# Altium project CW312_K82.PrjPcb
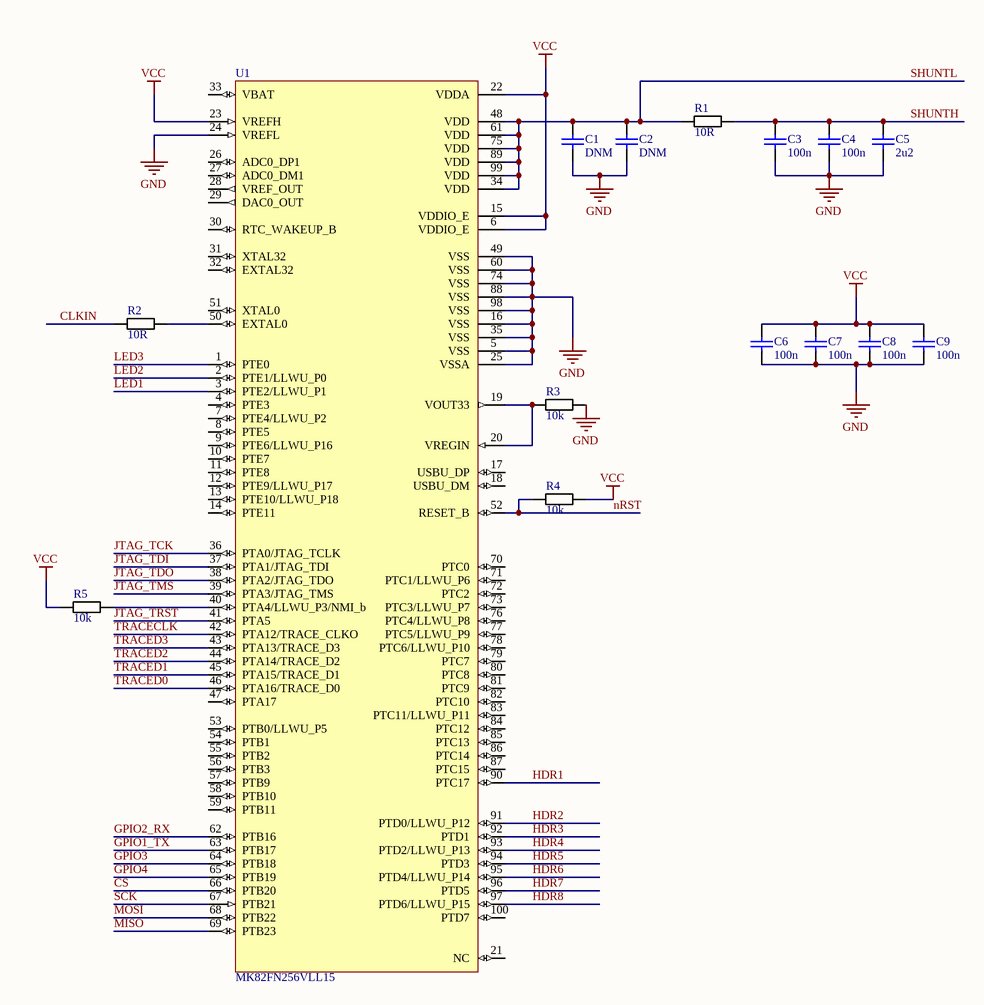
[diagram p0: CW312_K82.SchDoc]
PrjRev: 03; PrjName: K82 CW312 Target; PrjLicense: CC SA
2 sheets, 16 parts. Net scope: global (net labels, ports and power ports of the same name join across sheets).
Board files: cw312_k82.PcbDoc, CW312_K82_PANEL.PcbDoc
Sheets:
  CW312_K82.SchDoc
  CW312_K82_CardEdge.SchDoc

## Sheet CW312_K82.SchDoc: K82 Microcontroller
size Letter; Organization: NewAE Technology Inc.; Address1: 1083 Queen St., Suite 196; Address2: Halifax; Address3: NS; Address4: Canada B3H 0B2; DocumentNumber: .; Revision: .; SheetNumber: 1; SheetTotal: 2; SheetApproved: YES

### Parts
C1  DNM  [CAPC0603_M]
C2  DNM  [CAPC0603_M]
C3  100n  [CAPC0603_M]
C4  100n  [CAPC0603_M]
C5  2u2  [CAPC0603_M]
C6  100n  [CAPC0603_M]
C7  100n  [CAPC0603_M]
C8  100n  [CAPC0603_M]
C9  100n  [CAPC0603_M]
R1  10R  [RESC1608X55N]
R2  10R  [RESC1608X55N]
R3  10k  [RESC1608X55N]
R4  10k  [RESC1608X55N]
R5  10k  [RESC1608X55N]
U1  MK82FN256VLL15  [SQFP50P1600X1600X170-100N]

### Nets
GND: C1.2 C2.2 C3.2 C4.2 C5.2 C6.2 C7.2 C8.2 C9.2 R3.2 U1.5(VSS) U1.16(VSS) U1.24(VREFL) U1.25(VSSA) U1.35(VSS) U1.49(VSS) U1.60(VSS) U1.74(VSS) U1.88(VSS) U1.98(VSS)
VCC: C6.1 C7.1 C8.1 C9.1 R4.2 R5.1 U1.6(VDDIO_E) U1.15(VDDIO_E) U1.22(VDDA) U1.23(VREFH)  [project net FILTIN]
CLKIN: R2.1
CS: U1.66(PTB20)
GPIO1_TX: U1.63(PTB17)
GPIO2_RX: U1.62(PTB16)
GPIO3: U1.64(PTB18)
GPIO4: U1.65(PTB19)
HDR1: U1.90(PTC17)
HDR2: U1.91(PTD0/LLWU_P12)
HDR3: U1.92(PTD1)
HDR4: U1.93(PTD2/LLWU_P13)
HDR5: U1.94(PTD3)
HDR6: U1.95(PTD4/LLWU_P14)
HDR7: U1.96(PTD5)
HDR8: U1.97(PTD6/LLWU_P15)
JTAG_TCK: U1.36(PTA0/JTAG_TCLK)
JTAG_TDI: U1.37(PTA1/JTAG_TDI)
JTAG_TDO: U1.38(PTA2/JTAG_TDO)
JTAG_TMS: U1.39(PTA3/JTAG_TMS)
JTAG_TRST: U1.41(PTA5)
LED1: U1.3(PTE2/LLWU_P1)
LED2: U1.2(PTE1/LLWU_P0)
LED3: U1.1(PTE0)
MISO: U1.69(PTB23)
MOSI: U1.68(PTB22)
nRST: R4.1 U1.52(RESET_B)
SCK: U1.67(PTB21)
SHUNTH: C3.1 C4.1 C5.1 R1.2  [project net FILT_HP]
SHUNTL: C1.1 C2.1 R1.1 U1.34(VDD) U1.48(VDD) U1.61(VDD) U1.75(VDD) U1.89(VDD) U1.99(VDD)
TRACECLK: U1.42(PTA12/TRACE_CLKO)
TRACED0: U1.46(PTA16/TRACE_D0)
TRACED1: U1.45(PTA15/TRACE_D1)
TRACED2: U1.44(PTA14/TRACE_D2)
TRACED3: U1.43(PTA13/TRACE_D3)
NetR2_2: R2.2 U1.50(EXTAL0)
NetR3_1: R3.1 U1.19(VOUT33) U1.20(VREGIN)
NetR5_2: R5.2 U1.40(PTA4/LLWU_P3/NMI_b)

Not connected (* = marked no-connect by the designer): U1 4(PTE3) 7(PTE4/LLWU_P2) 8(PTE5) 9(PTE6/LLWU_P16) 10(PTE7) 11(PTE8) 12(PTE9/LLWU_P17) 13(PTE10/LLWU_P18) 14(PTE11) 17(USBU_DP) 18(USBU_DM) 21(NC) 26(ADC0_DP1) 27(ADC0_DM1) 28(VREF_OUT) 29(DAC0_OUT) 30(RTC_WAKEUP_B) 31(XTAL32) 32(EXTAL32) 33(VBAT) 47(PTA17) 51(XTAL0) 53(PTB0/LLWU_P5) 54(PTB1) 55(PTB2) 56(PTB3) 57(PTB9) 58(PTB10) 59(PTB11) 70(PTC0) 71(PTC1/LLWU_P6) 72(PTC2) 73(PTC3/LLWU_P7) 76(PTC4/LLWU_P8) 77(PTC5/LLWU_P9) 78(PTC6/LLWU_P10) 79(PTC7) 80(PTC8) 81(PTC9) 82(PTC10) 83(PTC11/LLWU_P11) 84(PTC12) 85(PTC13) 86(PTC14) 87(PTC15) 100(PTD7)

### Notes on the sheet
- Title:
- Date:
- Rev:
- Time:
- Project:
- Sheet
- of
- License:
- Copyright © NewAE Technology Inc.
- Approved:
- NewAE.com
- File:

### Library data of the parts
C1 C2 = CCHIP-100n-0603: Manufacture 1: Kemet; Manufacture Part Number 1: C0603C104K5RACTU; Component Group: Capacitor; Value: 100n; Case-EIA: 0603; Case-Metric: 1608; Rated Voltage: 50VDC; Part Number: CCHIP-100n-0603; Footprint: 0603; Pin Count: 2; Supplier 1: Digi-Key; Supplier Part Number 1: 399-5089-2-ND; Mounting Technology: SMT; Component Kind: Standard; Component Type: Standard
C3 C4 C6-C9 = CCHIP-100n-0603: 100n, 0603; Manufacture 1: Kemet; Manufacture Part Number 1: C0603C104K5RACTU; Component Group: Capacitor; Case-EIA: 0603; Case-Metric: 1608; Rated Voltage: 50VDC; Part Number: CCHIP-100n-0603; Footprint: 0603; Pin Count: 2; Supplier 1: Digi-Key; Supplier Part Number 1: 399-5089-2-ND; Value: 100n; Mounting Technology: SMT; Component Kind: Standard; Component Type: Standard
C5 = CCHIP-2u2-0603: 2u2, 0603; Manufacture 1: Samsung; Manufacture Part Number 1: CL10B225KP8NNNC; Component Group: Capacitor; Case-EIA: 0603; Case-Metric: 1608; Rated Voltage: 10VDC; Part Number: CCHIP-2u2-0603; Footprint: 0603; Pin Count: 2; Supplier 1: Digi-Key; Supplier Part Number 1: 1276-1134-2-ND; Value: 2u2; Mounting Technology: SMT; Component Kind: Standard; Component Type: Standard
R1 R2 = RCHIP-10R-0603: 10R res, 0603, 1%, 1/10W; Manufacture 1: Yageo; Manufacture Part Number 1: RC0603FR-0710RL; Component Group: Resistor; Case-EIA: 0603; Case-Metric: 1608; Rated Power: 0.1W; Rated Voltage: 75VDC; Part Number: RCHIP-10R-0603; Footprint: 0603; Pin Count: 2; Supplier 1: Digi-Key; Supplier Part Number 1: 311-10.0HRCT-ND; Value: 10R; Tolerance: 1%; Mounting Technology: SMT; Temperature Range: -55C to 155C; Component Kind: Standard; Component Type: Standard
R3-R5 = RCHIP-10K-0603: 10k res, 0603, 1%, 1/10W; Manufacture 1: Yageo; Manufacture Part Number 1: RC0603FR-0710KL; Component Group: Resistor; Case-EIA: 0603; Case-Metric: 1608; Rated Power: 0.1W; Rated Voltage: 75VDC; Part Number: RCHIP-10K-0603; Footprint: 0603; Pin Count: 2; Supplier 1: Digi-Key; Supplier Part Number 1: 311-10.0KHRCT-ND; Value: 10k; Tolerance: 1%; Mounting Technology: SMT; Temperature Range: -55C to 155C; Component Kind: Standard; Component Type: Standard
U1 = MK82FN256VLL15: ARM® Cortex®-M4 Kinetis K8x Microcontroller IC 32-Bit 150MHz 256KB (256K x 8) FLASH 100-LQFP (14x14); Manufacture 1: NXP; Component Group: Digital IC; PP Material Stack: 0; Part Number: MK82FN256VLL15; Footprint: TQFP100; Manufacture Part Number 1: MK82FN256VLL15; Pin Count: 100; Supplier 1: Digi-Key; Supplier Part Number 1: MK82FN256VLL15-ND; Mounting Technology: SMT; RoHS: Yes; Component Kind: Standard; Component Type: Standard; PP Rotation: 0

## Sheet CW312_K82_CardEdge.SchDoc: CW312 Connections
size Letter; Organization: NewAE Technology Inc.; Address1: 1083 Queen St., Suite 196; Address2: Halifax; Address3: NS; Address4: Canada B3H 0B2; DocumentNumber: .; Revision: .; SheetNumber: 2; SheetTotal: 2; SheetApproved: YES
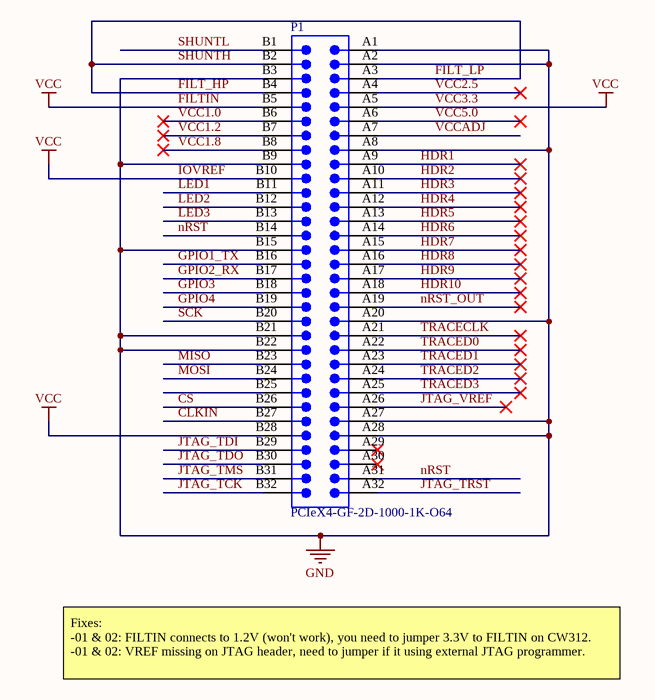
[diagram p1: CW312_K82_CardEdge.SchDoc]

### Parts
P1  PCIeX4-GF-2D-1000-1K-O64  [PCIeX4-GF-2D-1000-1K-O64]  (no BOM)

### Nets
FILTIN: P1.A5 P1.B5 P1.B10 P1.B28  [also labelled IOVREF, VCC, VCC3.3]
GND: P1.A1 P1.A2 P1.A8 P1.A20 P1.A27 P1.A28 P1.B3 P1.B9 P1.B15 P1.B21 P1.B22
CLKIN: P1.B27
CS: P1.B26
FILT_HP: P1.A3 P1.B2 P1.B4  [also labelled FILT_LP, SHUNTH]
GPIO1_TX: P1.B16
GPIO2_RX: P1.B17
GPIO3: P1.B18
GPIO4: P1.B19
HDR1: P1.A9
HDR2: P1.A10
HDR3: P1.A11
HDR4: P1.A12
HDR5: P1.A13
HDR6: P1.A14
HDR7: P1.A15
HDR8: P1.A16
HDR9: P1.A17
HDR10: P1.A18
JTAG_TCK: P1.B32
JTAG_TDI: P1.B29
JTAG_TDO: P1.B30
JTAG_TMS: P1.B31
JTAG_TRST: P1.A32
JTAG_VREF: P1.A26
LED1: P1.B11
LED2: P1.B12
LED3: P1.B13
MISO: P1.B23
MOSI: P1.B24
nRST: P1.A31 P1.B14
nRST_OUT: P1.A19
SCK: P1.B20
SHUNTL: P1.B1
TRACECLK: P1.A21
TRACED0: P1.A22
TRACED1: P1.A23
TRACED2: P1.A24
TRACED3: P1.A25
VCC1.0: P1.B6
VCC1.2: P1.B7
VCC1.8: P1.B8
VCC2.5: P1.A4
VCC5.0: P1.A6
VCCADJ: P1.A7

Not connected (* = marked no-connect by the designer): P1 A29* A30* B25

### Notes on the sheet
- Fixes:
  -01 & 02: FILTIN connects to 1.2V (won't work), you need to jumper 3.3V to FILTIN on CW312.
  -01 & 02: VREF missing on JTAG header, need to jumper if it using external JTAG programmer.
- Title:
- Date:
- Rev:
- Time:
- Project:
- Sheet
- of
- License:
- Copyright © NewAE Technology Inc.
- Approved:
- NewAE.com
- File:

### Library data of the parts
P1 = CMP-0001-00031-2: Golden finger, PCIeX4, Dual, Opposite, Pitch 1mm, 64-Position; Mating Connector: Molex-87715-9106; Publisher: Altium; ClassName: Edge Connector; Datasheet Version: rev2.0, Apr-2007; Package Reference: PCIeX4-GF-2D-1000-1K-O64

## Nets that join several sheets
FILTIN: CW312_K82 (10 pins), CW312_K82_CardEdge (P1.A5 P1.B5 P1.B10 P1.B28)
GND: CW312_K82 (20 pins), CW312_K82_CardEdge (11 pins)
CLKIN: CW312_K82 (R2.1), CW312_K82_CardEdge (P1.B27)
CS: CW312_K82 (U1.66), CW312_K82_CardEdge (P1.B26)
FILT_HP: CW312_K82 (C3.1 C4.1 C5.1 R1.2), CW312_K82_CardEdge (P1.A3 P1.B2 P1.B4)
GPIO1_TX: CW312_K82 (U1.63), CW312_K82_CardEdge (P1.B16)
GPIO2_RX: CW312_K82 (U1.62), CW312_K82_CardEdge (P1.B17)
GPIO3: CW312_K82 (U1.64), CW312_K82_CardEdge (P1.B18)
GPIO4: CW312_K82 (U1.65), CW312_K82_CardEdge (P1.B19)
HDR1: CW312_K82 (U1.90), CW312_K82_CardEdge (P1.A9)
HDR2: CW312_K82 (U1.91), CW312_K82_CardEdge (P1.A10)
HDR3: CW312_K82 (U1.92), CW312_K82_CardEdge (P1.A11)
HDR4: CW312_K82 (U1.93), CW312_K82_CardEdge (P1.A12)
HDR5: CW312_K82 (U1.94), CW312_K82_CardEdge (P1.A13)
HDR6: CW312_K82 (U1.95), CW312_K82_CardEdge (P1.A14)
HDR7: CW312_K82 (U1.96), CW312_K82_CardEdge (P1.A15)
HDR8: CW312_K82 (U1.97), CW312_K82_CardEdge (P1.A16)
JTAG_TCK: CW312_K82 (U1.36), CW312_K82_CardEdge (P1.B32)
JTAG_TDI: CW312_K82 (U1.37), CW312_K82_CardEdge (P1.B29)
JTAG_TDO: CW312_K82 (U1.38), CW312_K82_CardEdge (P1.B30)
JTAG_TMS: CW312_K82 (U1.39), CW312_K82_CardEdge (P1.B31)
JTAG_TRST: CW312_K82 (U1.41), CW312_K82_CardEdge (P1.A32)
LED1: CW312_K82 (U1.3), CW312_K82_CardEdge (P1.B11)
LED2: CW312_K82 (U1.2), CW312_K82_CardEdge (P1.B12)
LED3: CW312_K82 (U1.1), CW312_K82_CardEdge (P1.B13)
MISO: CW312_K82 (U1.69), CW312_K82_CardEdge (P1.B23)
MOSI: CW312_K82 (U1.68), CW312_K82_CardEdge (P1.B24)
nRST: CW312_K82 (R4.1 U1.52), CW312_K82_CardEdge (P1.A31 P1.B14)
SCK: CW312_K82 (U1.67), CW312_K82_CardEdge (P1.B20)
SHUNTL: CW312_K82 (9 pins), CW312_K82_CardEdge (P1.B1)
TRACECLK: CW312_K82 (U1.42), CW312_K82_CardEdge (P1.A21)
TRACED0: CW312_K82 (U1.46), CW312_K82_CardEdge (P1.A22)
TRACED1: CW312_K82 (U1.45), CW312_K82_CardEdge (P1.A23)
TRACED2: CW312_K82 (U1.44), CW312_K82_CardEdge (P1.A24)
TRACED3: CW312_K82 (U1.43), CW312_K82_CardEdge (P1.A25)